# EAGLE design attiny84 (EAGLE 6.4)
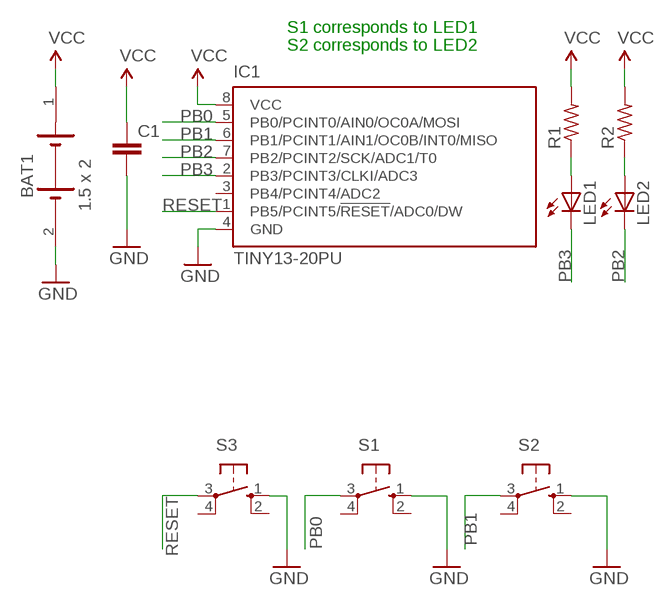
[diagram p0: schematic, sheet 1]

## Parts
BAT1  1.5 x 2  1.5X2BATTERYRELIMATE  [RELIMATE]
C1  C2.5/2  [C2.5-2]
IC1  TINY13-20PU  [DIL08]
LED1  LED3MM  [LED3MM]
LED2  LED3MM  [LED3MM]
R1  R-US_0207/10  [0207/10]
R2  R-US_0207/10  [0207/10]
S1  10-XX  [B3F-10XX]
S2  10-XX  [B3F-10XX]
S3  10-XX  [B3F-10XX]

## Nets
GND: BAT1.2 C1.2 IC1.4(GND) S1.1(S) S2.1(S) S3.1(S)
N$3: LED1.A R1.1
N$4: LED2.A R2.1
PB0: IC1.5(PB0/PCINT0/AIN0/OC0A/MOSI) S1.3(P)
PB1: IC1.6(PB1/PCINT1/AIN1/OC0B/INT0/MISO) S2.3(P)
PB2: IC1.7(PB2/PCINT2/SCK/ADC1/T0) LED2.K(C)
PB3: IC1.2(PB3/PCINT3/CLKI/ADC3) LED1.K(C)
RESET: IC1.1(PB5/PCINT5/!RESET!/ADC0/DW) S3.3(P)
VCC: BAT1.1 C1.1 IC1.8(VCC) R1.2 R2.2
Unconnected: IC1.3(PB4/PCINT4/ADC2) S1.2(S1) S1.4(P1) S2.2(S1) S2.4(P1) S3.2(S1) S3.4(P1)

## Notes on the sheet
- S1 corresponds to LED1
- S2 corresponds to LED2

## Library data of the parts
BAT1 = nehul:1.5X2BATTERY
C1 = capacitor-wima:C: CAPACITOR naming: grid - package width
IC1 = atmel:TINY13: 8-bit AVR Microcontroller with 1K Bytes In-System Programmable Flash Source: http://www.atmel.com/dyn/resources/prod_documents/2535S.pdf
LED1 LED2 = SparkFun:LED: LEDs Standard schematic elements and footprints for 5mm, 3mm, 1206, and 0603 sized LEDs. 5mm - Spark Fun Electronics SKU : COM-00529 (and others)
R1 R2 = rcl:R-US_: RESISTOR, American symbol
S1-S3 = switch-omron:10-XX: OMRON SWITCH

## Board
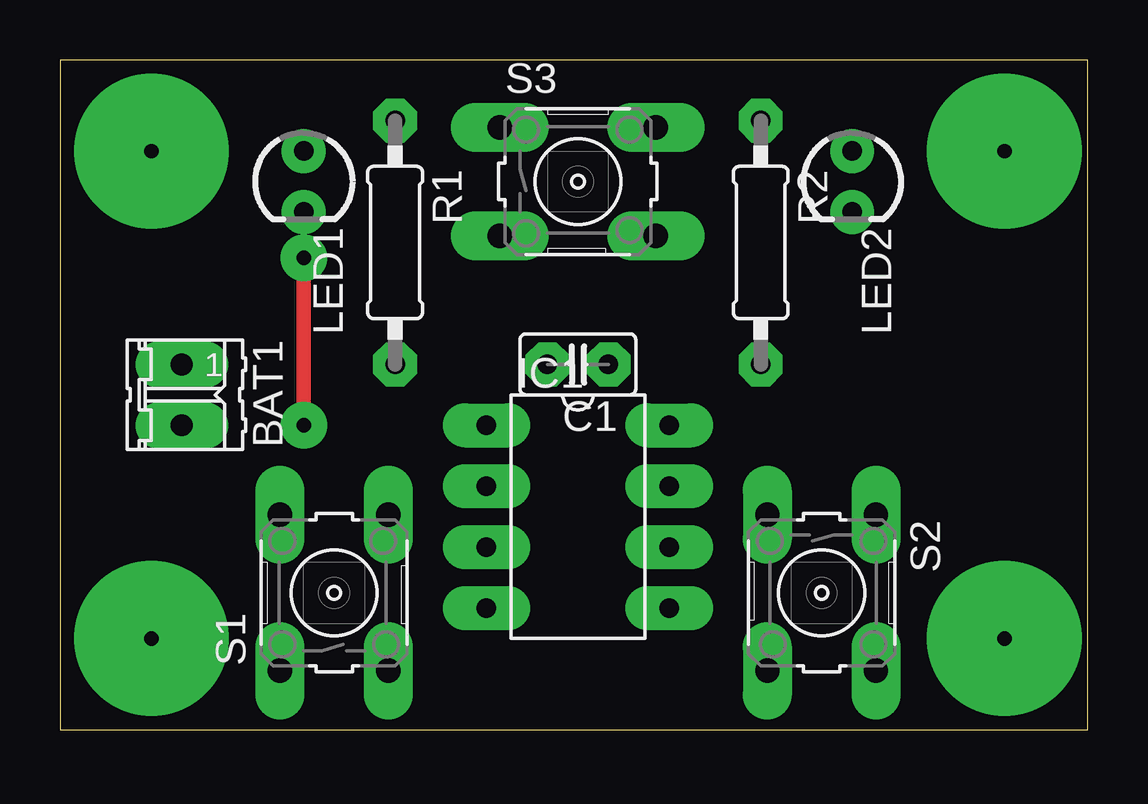
[diagram p1: board, top side]
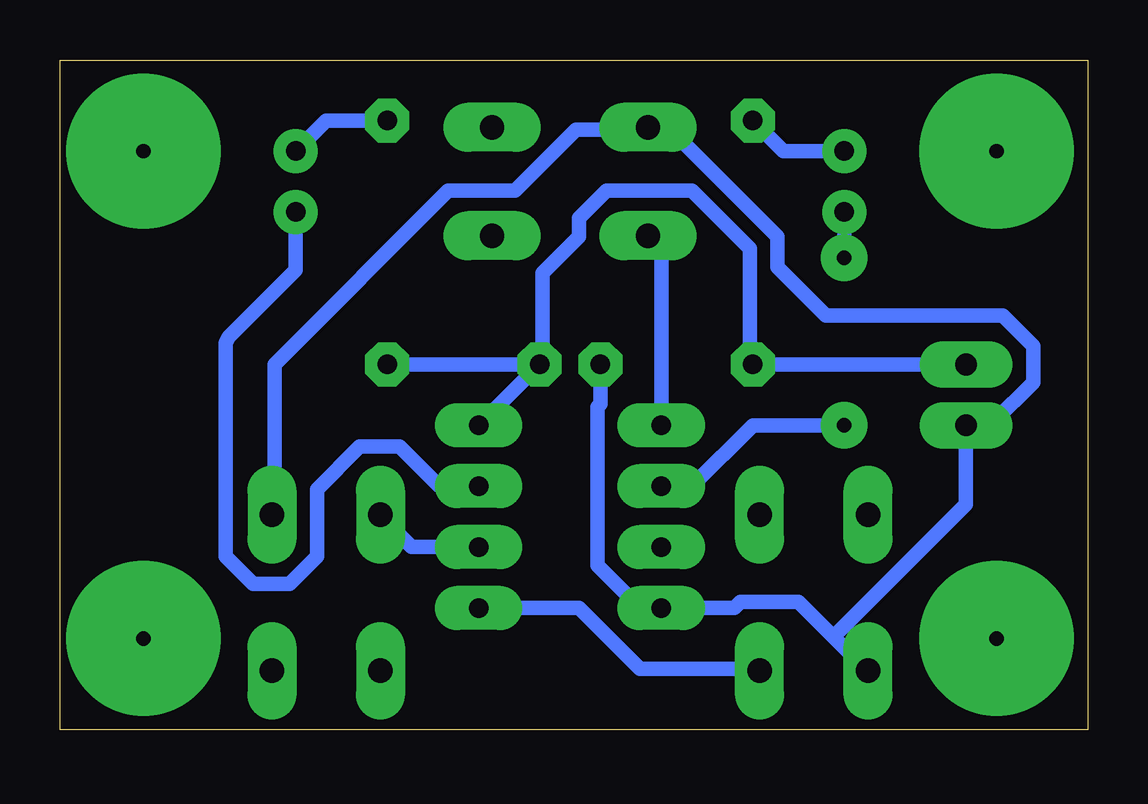
[diagram p2: board, bottom side, seen from below]

Size 42.85 x 27.93 mm. Coordinates in mm from the lower left corner, seen from the top.
Outline: 0,0 42.85,0 42.85,27.93 0,27.93 0,0
Copper layers (1*16): Top 0.035mm / dielectric 1.5mm / Bottom 0.035mm
Design rules "default *": minimum track width 24mil, minimum drill 24mil, track to track 20mil, track to pad 20mil, pad to pad 20mil, via to via 20mil, smd to smd 20mil, copper to edge 40mil, drill to drill 8mil, minimum pad ring 20mil, minimum via ring 20mil, stop-mask expansion 4mil, vias tented up to drill 0mil, thermal gap 10mil

### Footprints (pad centres in the part's own frame; a part is rotated, then mirrored left to right if it is on the bottom)
RELIMATE = drill 0.914 long: 1 1.27,2.54; 2 3.81,2.54
C2.5-2 = drill 0.813 pad 1.6 octagon: 1 -1.27,0; 2 1.27,0
DIL08 = drill 0.813 long: 1 -3.81,-3.81; 2 -1.27,-3.81; 3 1.27,-3.81; 4 3.81,-3.81; 5 3.81,3.81; 6 1.27,3.81; 7 -1.27,3.81; 8 -3.81,3.81
LED3MM = drill 0.813: A -1.27,0; K 1.27,0
0207/10 = drill 0.813 octagon: 1 -5.08,0; 2 5.08,0
B3F-10XX = drill 1.016 long: 1 -3.251,2.261; 2 3.251,2.261; 3 -3.251,-2.261; 4 3.251,-2.261

### Placement (x,y rotation side)
BAT1  2.54,16.51 270 top
C1  21.59,15.24 180 top
IC1  21.59,8.89 270 top
LED1  10.16,22.86 270 top
LED2  33.02,22.86 270 top
R1  13.97,20.32 270 top
R2  29.21,20.32 270 top
S1  11.43,5.71 90 top
S2  31.75,5.71 270 top
S3  21.59,22.86 0 top

### Tracks (layer width: path | path; a pad name or v marks a point on that pad's centre or on a via)
GND
  Bottom 0.61: 10.6,3.87 9.27,2.54 S1.1 | 10.6,3.87 12.06,5.33 14.48,5.33 14.73,5.08 IC1.4 18.03,5.21 18.8,5.21 20.45,6.86 20.45,13.46 20.32,13.59 C1.2 | 10.6,3.87 5.08,9.4 BAT1.2 4.83,12.83 3.94,12.83 2.29,14.48 2.29,16 3.56,17.27 10.92,17.27 12.95,19.3 12.95,20.57 17.27,24.89 18.16,24.89 S3.1 18.41,25.02 21.34,25.02 23.88,22.48 26.67,22.48 33.91,15.24 33.91,9.02 S2.1
N$1  (via drill 0.6 pad 6.45)
  other vias: 3.81,3.81
N$2  (via drill 0.6 pad 6.45)
  other vias: 39.37,3.81
N$3
  Bottom 0.61: LED1.A 12.7,24.13 R1.1
N$4
  Bottom 0.61: R2.1 31.75,25.4 LED2.A
N$5  (via drill 0.6 pad 6.45)
  other vias: 39.37,24.13
N$6  (via drill 0.6 pad 6.45)
  other vias: 3.81,24.13
PB0
  Bottom 0.61: IC1.5 21.21,5.08 18.67,2.54 13.72,2.54 S1.3
PB1
  Bottom 0.61: IC1.6 28.19,7.62 29.46,8.89 S2.3
PB2
  Bottom 0.61: IC1.7 27.05,10.16 28.7,11.81 30.35,11.81 32.13,10.03 32.13,7.24 33.27,6.1 34.8,6.1 35.94,7.24 35.94,16.13 35.81,16.38 33.02,19.18 LED2.K
PB3  (via drill 0.6 pad 1.93)
  Top 0.61: v10.16,12.7 v10.16,19.68
  Bottom 0.61: IC1.2 16.51,10.16 13.97,12.7 v10.16,12.7 | v10.16,19.68 LED1.K
RESET
  Bottom 0.61: IC1.1 17.78,20.07 18.29,20.57 S3.3
VCC
  Bottom 0.61: C1.1 IC1.8 | C1.1 R2.2 | BAT1.1 R1.2 14.1,15.49 14.1,20.07 16.51,22.48 20.07,22.48 21.21,21.34 21.21,20.57 22.73,19.05 22.73,15.49 C1.1